# Altium schematic sheet Sheet1.SchDoc
size A4; SheetNumber: 1; SheetTotal: 1
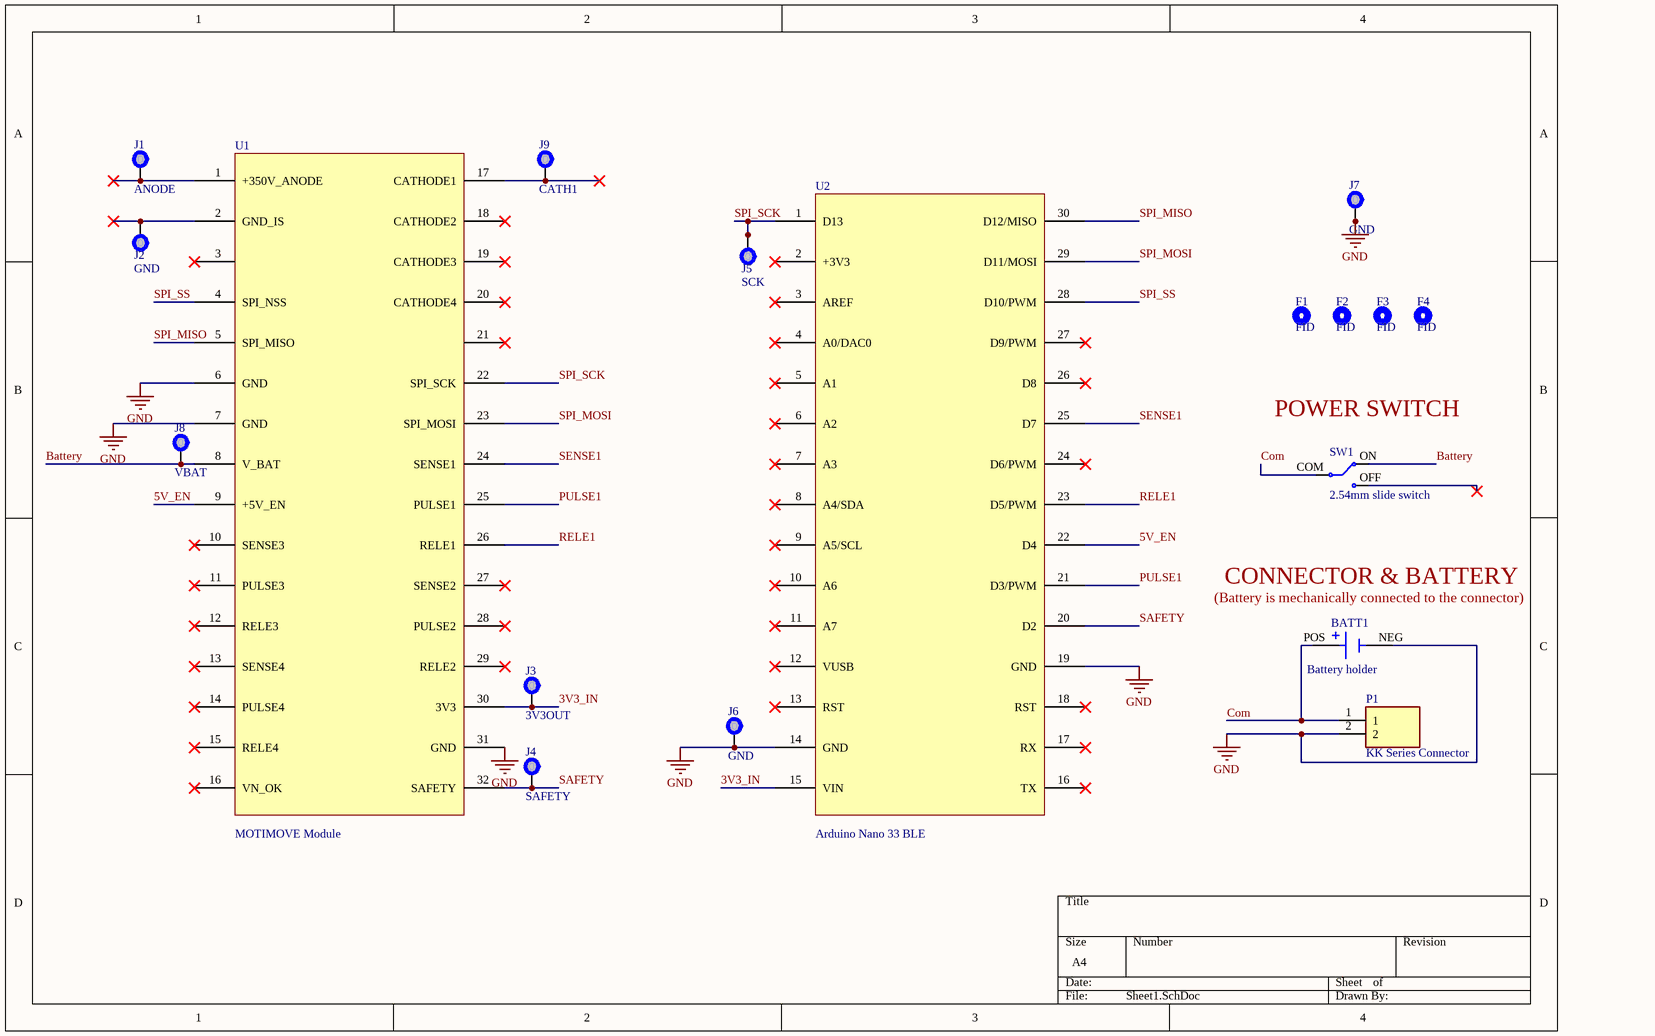
[diagram p0: Sheet1.SchDoc]

## Parts
BATT1  Battery holder  [BAT_BC3AAPC]
F1  FID  [Fiducial_1.5mm]
F2  FID  [Fiducial_1.5mm]
F3  FID  [Fiducial_1.5mm]
F4  FID  [Fiducial_1.5mm]
J1  ANODE  [TEST POINTS]
J2  GND  [TEST POINTS]
J3  3V3OUT  [TEST POINTS]
J4  SAFETY  [TEST POINTS]
J5  SCK  [TEST POINTS]
J6  GND  [TEST POINTS]
J7  GND  [TEST POINTS]
J8  VBAT  [TEST POINTS]
J9  CATH1  [TEST POINTS]
P1  KK Series Connector  [KK series connector header]
SW1  2.54mm slide switch  [2.54mm Mini Slide Switch]
U1  MOTIMOVE Module  [MOTIMOVE Module]
U2  Arduino Nano 33 BLE  [Arduino Nano 33 BLE]

## Nets
GND: BATT1.NEG J6.1 J7.1 P1.2 U1.6(GND) U1.7(GND) U1.31(GND) U2.14(GND) U2.19(GND)
3V3_IN: J3.1 U1.30(3V3) U2.15(VIN)
5V_EN: U1.9(+5V_EN) U2.22(D4)
Battery: J8.1 SW1.ON U1.8(V_BAT)
Com: BATT1.POS P1.1 SW1.COM(com)
PULSE1: U1.25(PULSE1) U2.21(D3/PWM)
RELE1: U1.26(RELE1) U2.23(D5/PWM)
SAFETY: J4.1 U1.32(SAFETY) U2.20(D2)
SENSE1: U1.24(SENSE1) U2.25(D7)
SPI_MISO: U1.5(SPI_MISO) U2.30(D12/MISO)
SPI_MOSI: U1.23(SPI_MOSI) U2.29(D11/MOSI)
SPI_SCK: J5.1 U1.22(SPI_SCK) U2.1(D13)
SPI_SS: U1.4(SPI_NSS) U2.28(D10/PWM)
NetJ1_1: J1.1 U1.1(+350V_ANODE)
NetJ2_1: J2.1 U1.2(GND_IS)
NetJ9_1: J9.1 U1.17(CATHODE1)

Not connected (* = marked no-connect by the designer): SW1 OFF*; U1 3* 10(SENSE3)* 11(PULSE3)* 12(RELE3)* 13(SENSE4)* 14(PULSE4)* 15(RELE4)* 16(VN_OK)* 18(CATHODE2)* 19(CATHODE3)* 20(CATHODE4)* 21* 27(SENSE2)* 28(PULSE2)* 29(RELE2)*; U2 2(+3V3)* 3(AREF)* 4(A0/DAC0)* 5(A1)* 6(A2)* 7(A3)* 8(A4/SDA)* 9(A5/SCL)* 10(A6)* 11(A7)* 12(VUSB)* 13(RST)* 16(TX)* 17(RX)* 18(RST)* 24(D6/PWM)* 26(D8)* 27(D9/PWM)*

## Notes on the sheet
- (near SW1) POWER SWITCH
- CONNECTOR & BATTERY
- (near BATT1) (Battery is mechanically connected to the connector)

## Library data of the parts
BATT1 = BC3AAPC: Holder Batt 4-AAA Cells Pc Mnt; Package: None; Price: None; Value: *; MP: BC3AAPC; Availability: Unavailable
F1-F4 = FIDUCIAL: 1.5mm Fiducial; Manufacturer Part Number: NA; Manufacturer: NA; Supplier: NA; Supplier Part Number: NA; Case/Package: SMD
J1-J9 = TEST POINTS: Test Points 1.02mm
P1 = Connector: CONNECTOR : KK Style - Straight Header / 02 Way / 2.54mm Pitch / With Friction Lock
SW1 = 2.54mm slide switch: Mouser - 710450301014042